# EAGLE design SensorBoard (EAGLE 7.4.0)
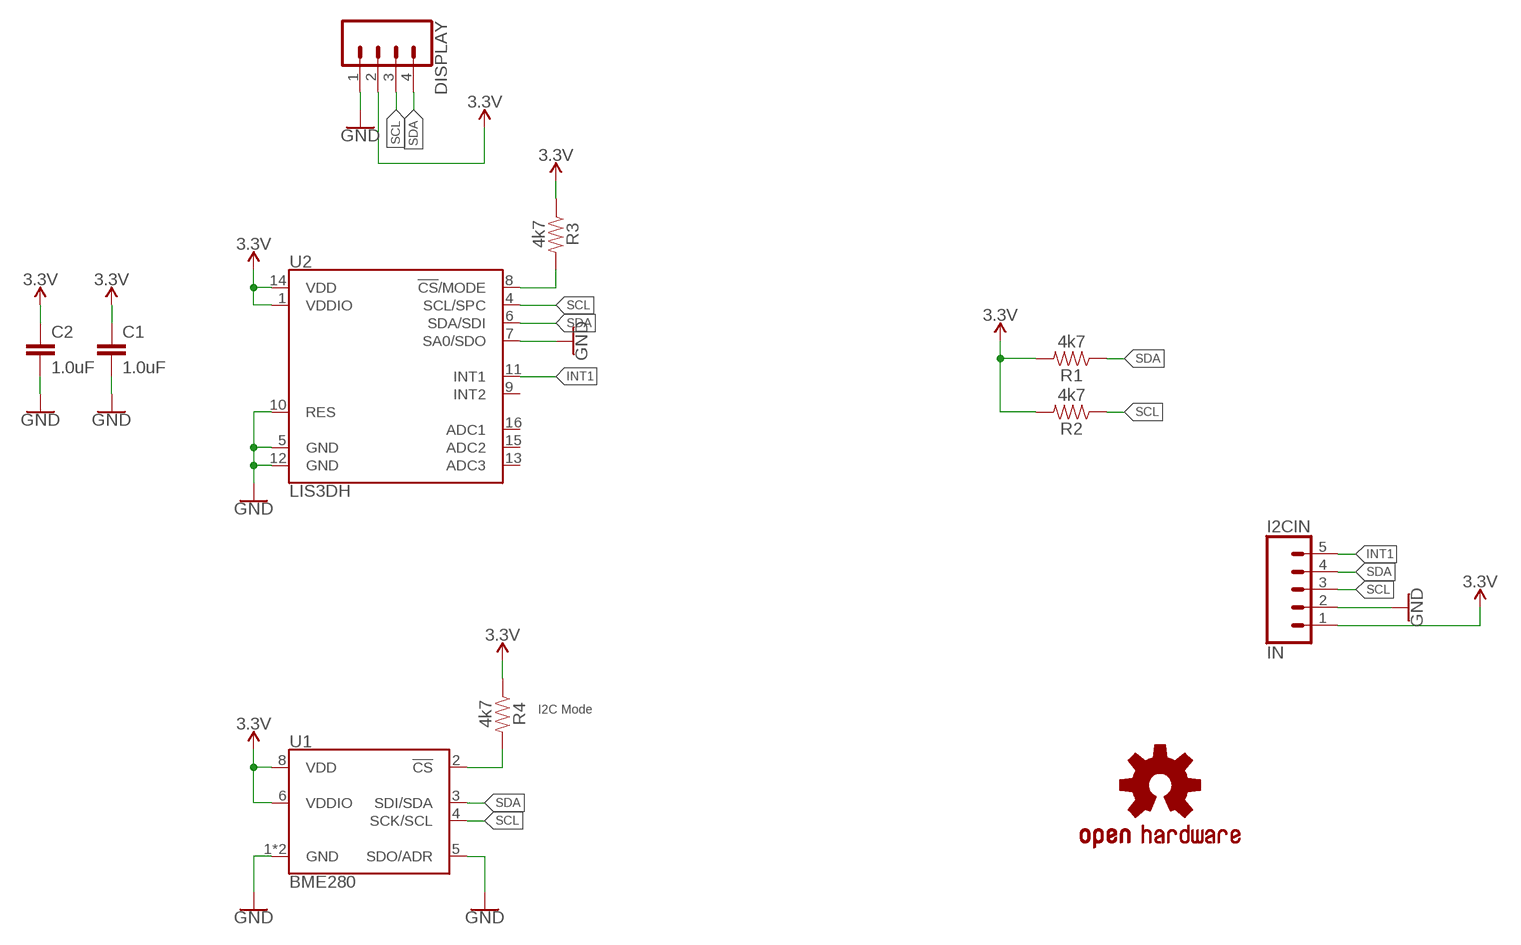
[diagram p0: schematic, sheet 1]

## Parts
C1  1.0uF  1.0UF-0805-25V-10%  [0805]
C2  1.0uF  1.0UF-0805-25V-10%  [0805]
DISPLAY  CONN_04  [1X04]
I2CIN  IN  CONN_05  [1X05]
LOGO1  OSHW-LOGOL  [OSHW-LOGO-L]
R1  4k7  RESISTOR0805  [0805]
R2  4k7  RESISTOR0805  [0805]
R3  4k7  RESISTOR0805  [0805]
R4  4k7  RESISTOR0805  [0805]
U1  BME280  [LGA-8-2.5X2.5]
U2  LIS3DH  [LGA-16-3X3]

## Nets
3.3V: C1.1 C2.1 DISPLAY.2 I2CIN.1 R1.2 R2.2 R3.1 R4.1 U1.6(VDDIO) U1.8(VDD) U2.1(VDDIO) U2.14(VDD)
GND: C1.2 C2.2 DISPLAY.1 I2CIN.2 U1.1(GND) U1.5(SDO/ADR) U1.7(GND) U2.5(GND) U2.7(SA0/SDO) U2.10(RES) U2.12(GND)
INT1: I2CIN.5 U2.11(INT1)
N$4: R4.2 U1.2(!CS)
N$12: R3.2 U2.8(!CS!/MODE)
SCL: DISPLAY.3 I2CIN.3 R2.1 U1.4(SCK/SCL) U2.4(SCL/SPC)
SDA: DISPLAY.4 I2CIN.4 R1.1 U1.3(SDI/SDA) U2.6(SDA/SDI)
Unconnected: U2.9(INT2) U2.13(ADC3) U2.15(ADC2) U2.16(ADC1)

## Notes on the sheet
- I2C Mode

## Library data of the parts
C1 C2 = SparkFun-Capacitors:1.0UF: 1µF ceramic capacitors A capacitor is a passive two-terminal electrical component used to store electrical energy temporarily in an electric field.; PROD_ID: CAP-08064
DISPLAY = SparkFun-Connectors:CONN_04: Multi connection point. Often used as Generic Header-pin footprint for 0.1 inch spaced/style header connections On any of the 0.1 inch spaced packages, you can populate with these: Break Away Headers - Straight <https://www.sparkfun.com/products/116> (PRT-00116) Break Away Male Headers - Right Angle <https://www.sparkfun.com/products/553> (PRT-00553) Female Headers <https://www.sparkfun.com/products/115> (PRT-00115) Break Away Headers - Machine Pin <https://www.sparkfun.com/products/117> (PRT-00117) Break Away Female Headers - Swiss Machine Pin <https://www.sparkfun.com/products/743> (PRT-00743) For SCREWTERMINALS and SPRING TERMINALS visit here: Screw Terimnals on SparkFun.com <https://www.sparkfun.com/search/results?term=Screw+Terminals> (5mm/3.5mm/2.54mm spacing) This device is also useful as a general connection point to wire up your design to another part of your project. Our various solder wires solder well into these plated through hole pads. Hook-Up Wire - Assortment (Stranded, 22 AWG) <https://www.sparkfun.com/products/11375> (PRT-11375) Hook-Up Wire - Assortment (Solid Core, 22 AWG) <https://www.sparkfun.com/products/11367> (PRT-11367) View the entire wire category on our website here <https://www.sparkfun.com/categories/141> Special notes: Molex polarized connector foot print use with SKU : PRT-08231 with associated crimp pins and housings. 1MM SMD Version SKU: PRT-10208; PROD_ID: CONN-09696
I2CIN = SparkFun-Connectors:CONN_05: Multi connection point. Often used as Generic Header-pin footprint for 0.1 inch spaced/style header connections On any of the 0.1 inch spaced packages, you can populate with these: Break Away Headers - Straight <https://www.sparkfun.com/products/116> (PRT-00116) Break Away Male Headers - Right Angle <https://www.sparkfun.com/products/553> (PRT-00553) Female Headers <https://www.sparkfun.com/products/115> (PRT-00115) Break Away Headers - Machine Pin <https://www.sparkfun.com/products/117> (PRT-00117) Break Away Female Headers - Swiss Machine Pin <https://www.sparkfun.com/products/743> (PRT-00743) For SCREWTERMINALS and SPRING TERMINALS visit here: Screw Terimnals on SparkFun.com <https://www.sparkfun.com/search/results?term=Screw+Terminals> (5mm/3.5mm/2.54mm spacing) This device is also useful as a general connection point to wire up your design to another part of your project. Our various solder wires solder well into these plated through hole pads. Hook-Up Wire - Assortment (Stranded, 22 AWG) <https://www.sparkfun.com/products/11375> (PRT-11375) Hook-Up Wire - Assortment (Solid Core, 22 AWG) <https://www.sparkfun.com/products/11367> (PRT-11367) View the entire wire category on our website here <https://www.sparkfun.com/categories/141> Special notes: Molex polarized connector foot print use with SKU : PRT-08231 with associated crimp pins and housings. 1MM SMD Version SKU: PRT-10208
LOGO1 = SparkFun-Aesthetics:OSHW-LOGO: Open-Source Hardware (OSHW) Logo This logo indicates the piece of hardware it is found on incorporates a OSHW license and/or adheres to the definition of open source hardware found here: http://freedomdefined.org/OSHW
R1-R4 = SparkFun-Resistors:RESISTOR: Generic Resistor Package
U1 = SparkFun-Sensors:BME280: Bosch BME280 – Combined Humidity and Pressure Sensor The BME280 is as combined digital humidity, pressure and temperature sensor based on proven sensing principles. The sensor module is housed in an extremely compact metal-lid LGA package with a footprint of only 2.5×2.5mm² with a height of 0.93mm. Its small dimensions and its low power consumption allow the implementation in battery driven devices such as handsets, GPS modules or watches. Datasheet <https://cdn.sparkfun.com/assets/learn_tutorials/4/1/9/BST-BME280_DS001-10.pdf> SparkFun Products SparkFun Atmospheric Sensor Breakout - BME280 <https://www.sparkfun.com/products/13676> (SEN-13676); PROD_ID: IC-13090
U2 = SparkFun-Sensors:LIS3DH: ST Microelectronics LIS3DH 3-Axis ±2/4/8/16g SPI/I2C Accelerometer The LIS3DH is a three axis MEMS linear accelerometer in the "nano" family. It has a digital I2C/SPI serial interface which makes it ideal for using in embedded applications. The device also features ultra low-power operational modes that allow advanced power saving and smart sleep to wake-up functions, built in detections with interrupts, and auxiliary ADC inputs Datasheet-XXXX <http://www.sparkfun.com/datasheets/Sensors/Accelerometer/LIS3DH.pdf> SparkFun Products SparkFun Triple Axis Accelerometer Breakout - LIS3DH <https://www.sparkfun.com/products/10345> (SEN-XXXXX) Triple Axis Accelerometer - LIS3DH <https://www.sparkfun.com/products/9755> (SEN-XXXXX); PROD_ID: IC-13419; SF_ID: N/A

## Board
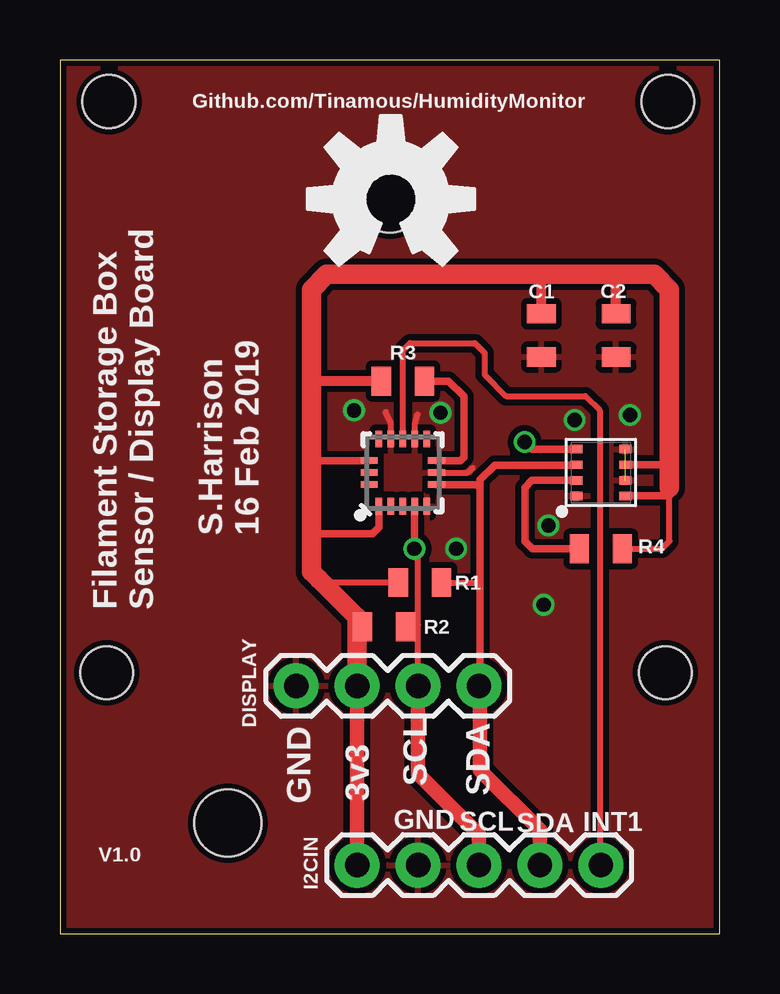
[diagram p1: board, top side]
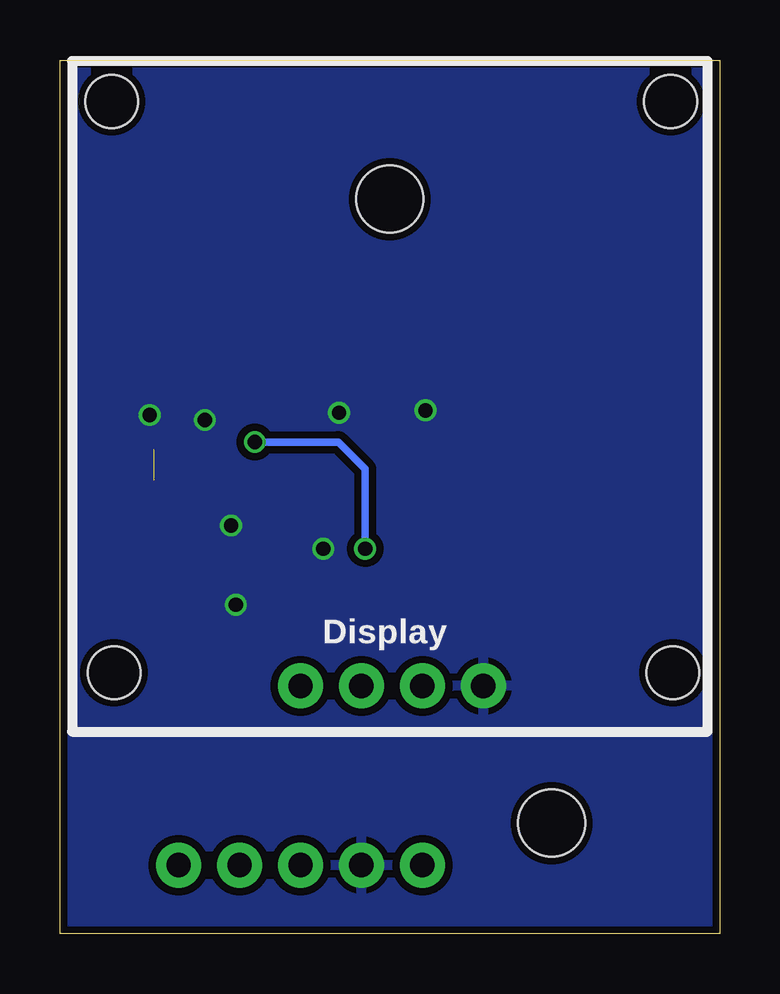
[diagram p2: board, bottom side, seen from below]

Size 27.5 x 36.4 mm. Coordinates in mm from the lower left corner, seen from the top.
Outline: 0,0 27.5,0 27.5,36.4 0,36.4 0,0
Copper layers (1*16): Top 0.035mm / dielectric 1.5mm / Bottom 0.035mm
Design rules "dirt_cheap_dirty_boards.v1.1": minimum track width 6mil, minimum drill 12mil, track to track 6mil, track to pad 6mil, pad to pad 6mil, via to via 6mil, smd to smd 0mil, copper to edge 10mil, drill to drill 10mil, minimum pad ring 10mil, minimum via ring 6mil, stop-mask expansion 2mil, vias tented up to drill 25mil, thermal gap 10mil
Holes 2.8 mm at 13.75,30.6 7,4.6
Holes 2.2 mm at 1.94,10.87 25.24,10.87 2.04,34.67 25.34,34.67

### Footprints (pad centres in the part's own frame; a part is rotated, then mirrored left to right if it is on the bottom)
0805 = smd 0.8 x 1.2: 1 -0.9,0; 2 0.9,0
1X04 = drill 1.016 pad 1.88: 1 0,0; 2 2.54,0; 3 5.08,0; 4 7.62,0
1X05 = drill 1.016 pad 1.88: 1 0,0; 2 2.54,0; 3 5.08,0; 4 7.62,0; 5 10.16,0
LGA-8-2.5X2.5 = smd 0.35 x 0.5: 1 -0.975,1.025; 2 -0.325,1.025; 3 0.325,1.025; 4 0.975,1.025; 5 0.975,-1.025; 6 0.325,-1.025; 7 -0.325,-1.025; 8 -0.975,-1.025
LGA-16-3X3 = smd 0.7 x 0.28: 1 -1.4,1; 2 -1.4,0.5; 3 -1.4,0; 4 -1.4,-0.5; 5 -1.4,-1; 9 1.4,-1; 10 1.4,-0.5; 11 1.4,0; 12 1.4,0.5; 13 1.4,1 | smd 0.28 x 0.7: 6 -0.5,-1.4; 7 0,-1.4; 8 0.5,-1.4; 14 0.5,1.4; 15 0,1.4; 16 -0.5,1.4

### Placement (x,y rotation side)
C1  20.07,24.93 270 top
C2  23.18,24.93 270 top
DISPLAY  9.85,10.32 0 top
I2CIN  12.39,2.85 0 top
LOGO1  13.8,30.6 0 top
R1  15.01,14.63 180 top
R2  13.51,12.78 180 top
R3  14.29,23.02 0 top
R4  22.55,16.04 180 top
U1  22.55,19.21 90 top
U2  14.29,19.21 90 top

### Tracks (layer width: path | path; a pad name or v marks a point on that pad's centre or on a via)
3.3V
  Top 0.254: R2.2 12.47,12.78 12.39,12.86 | R1.2 10.94,14.62 10.8,14.77 | R4.1 25.09,16.04 25.41,16.35 25.41,18.23
  Top 0.305: U2.14 10.62,19.71 10.48,19.84 | U2.1 13.29,16.94 13.03,16.67 10.48,16.67 | U1.8 25.07,18.23 | 25.41,18.23 25.07,18.23 | 25.07,18.23 25.41,18.58 | U1.6 25.1,19.54 25.41,19.84 | 10.44,18.54 10.48,18.5
  Top 0.406: C2.1 23.18,27.47 | C1.1 20.07,27.47 | R3.1 10.48,23.02
  Top 0.61: I2CIN.1 DISPLAY.2
  Top 0.813: 25.41,18.58 25.41,19.84 25.41,26.83 24.77,27.47 23.18,27.47 20.07,27.47 11.12,27.47 10.48,26.83 10.48,23.02 10.48,19.84 10.48,18.5 10.48,16.67 10.48,15.08 10.8,14.77 12.39,13.18 12.39,12.86 DISPLAY.2
GND  (via drill 0.6)  (1 unrouted)
  Top 0.254: U2.10 14.79,21.25 14.91,21.63 | U2.12 13.79,21.25 13.58,21.73 | U2.7 17.01,19.21 17.2,19.4
  Top 0.305: 23.54,18.85 U1.7
  other vias: 21.46,21.4 16.52,16.04 20.16,13.7 15.86,21.7 12.26,21.8 23.76,21.6 20.36,17
  pour Bottom (isolate 0.305): -0.01,36.47 27.5,36.78 27.33,0.06 -0.11,0.01
  pour Top (isolate 0.254): 0.02,0.03 27.43,-0.04 27.6,36.53 -0.01,36.37
INT1
  Top 0.254: U2.11 14.29,21.8 14.3,21.8 14.3,24.3 14.6,24.6 17.3,24.6 17.7,24.2 17.7,23.3 18.6,22.4 21.9,22.4 22.5,21.8 22.5,2.9 I2CIN.5
N$4
  Top 0.305: U1.2 19.68,18.88 19.38,18.58 19.38,16.35 19.69,16.04 R4.2
N$12
  Top 0.305: U2.8 16.7,19.71 16.84,19.84 16.84,22.38 16.2,23.02 R3.2
SCL  (via drill 0.6)
  Top 0.254: DISPLAY.3 14.93,12.86 | 14.93,12.86 14.93,15.88 v14.78,16.04 | R2.1 14.85,12.78 14.93,12.86
  Top 0.305: U2.4 14.78,17.81 v14.78,16.04 | U1.4 19.67,20.19 v19.38,20.48
  Top 0.61: I2CIN.3 17.47,4.12 14.93,6.66 DISPLAY.3
  Bottom 0.305: v19.38,20.48 15.89,20.48 14.78,19.36 v14.78,16.04
SDA
  Top 0.254: R1.1 17.38,14.62 17.52,14.77
  Top 0.305: DISPLAY.4 17.52,10.37 17.52,14.77 17.52,18.58 | 17.52,18.58 17.52,18.91 18.13,19.52 21.5,19.52 U1.3 | U2.6 17.39,18.71 17.52,18.58
  Top 0.61: I2CIN.4 20.01,4.33 17.52,6.82 17.52,10.27 DISPLAY.4

### Text on the board
bPlace: Display
tNames: Github.com/Tinamous/HumidityMonitor | S.Harrison / 16 Feb 2019 | Filament Storage Box / Sensor / Display Board | GND | SCL | SDA | 3v3 | GND | SCL | SDA | INT1 | V1.0
Document: Looking at back of display / with connector at the bottom